# Altium schematic sheet OpAmp_CH1.SchDoc
size A4; CompanyName: Technische Hochschule Nürnberg Georg Simon Ohm; Organization: UltraZohm; Address1: Kesslerplatz 12; Address2: 90489 Nürnberg; Address3: GERMANY; DocumentNumber: 5; SheetNumber: 5; SheetTotal: 6; Website: www.ultrazohm.com
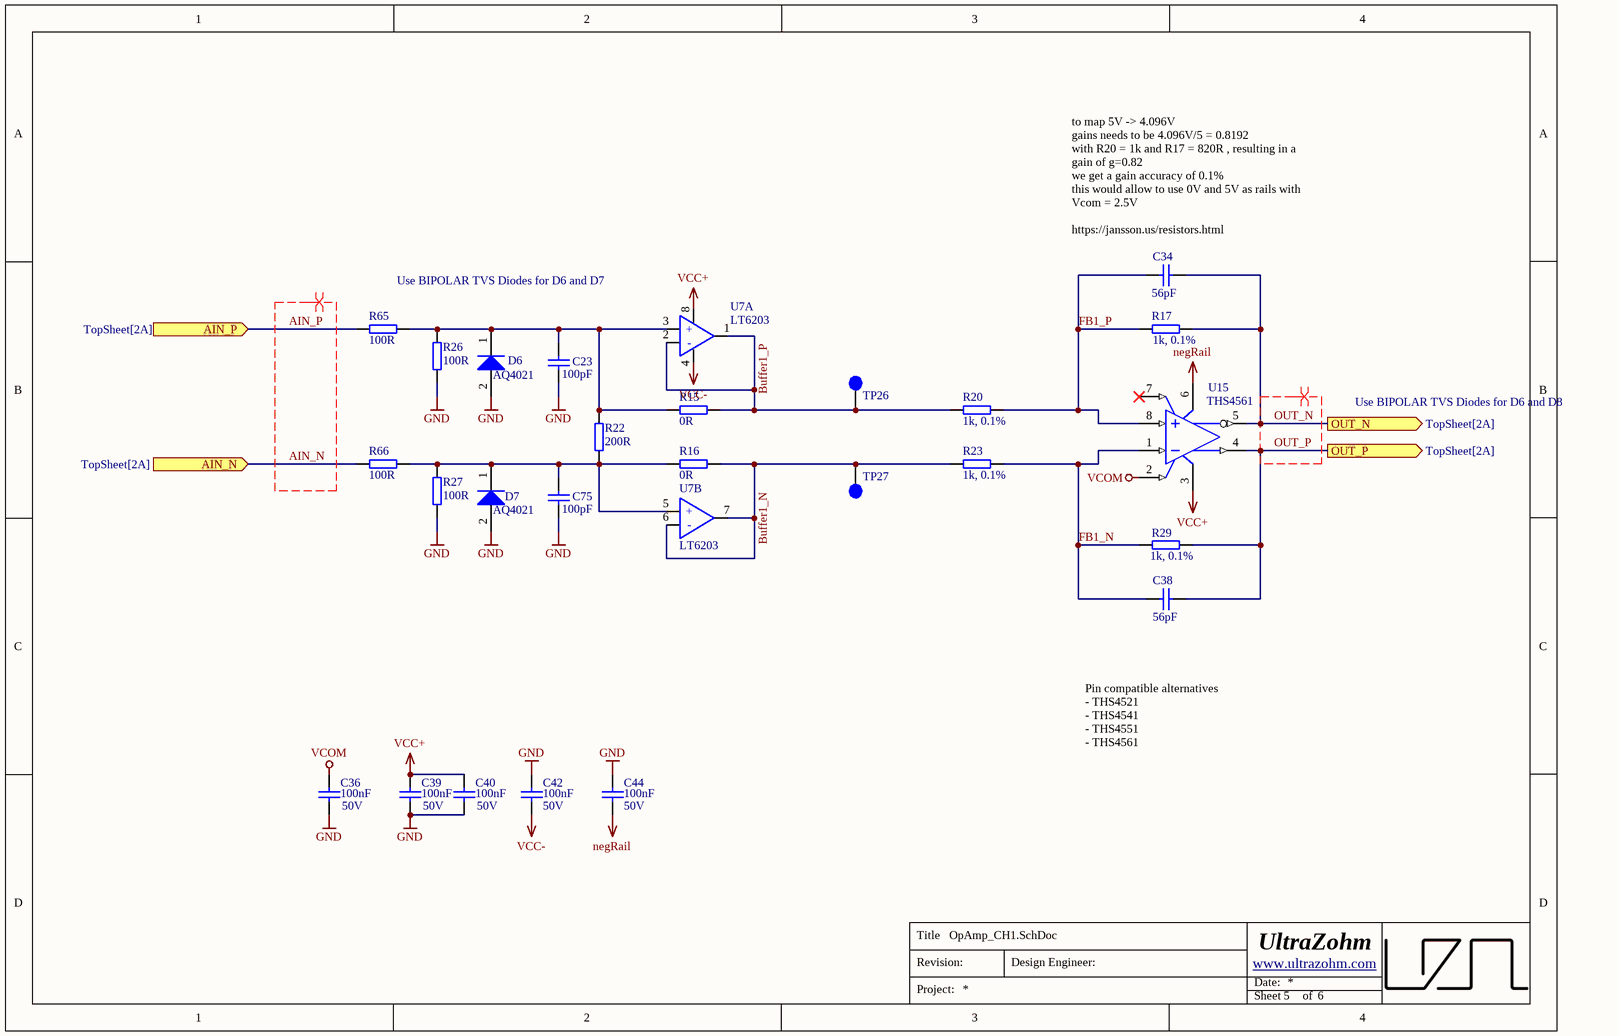
[diagram p0: OpAmp_CH1.SchDoc]

## Parts
C23  100pF  [CAPC1608X07N]
C34  56pF  [CAPC1608X07N]
C36  100nF  Voltage: 50V  [CAPC1608X07N]
C38  56pF  [CAPC1608X07N]
C39  100nF  Voltage: 50V  [CAPC1608X07N]
C40  100nF  Voltage: 50V  [CAPC1608X07N]
C42  100nF  Voltage: 50V  [CAPC1608X07N]
C44  100nF  Voltage: 50V  [CAPC1608X07N]
C75  100pF  [CAPC1608X07N]
D6  AQ4021  [SOD-323_SuppressorDiode]
D7  AQ4021  [SOD-323_SuppressorDiode]
R15  0R  [RESC1608X06N]
R16  0R  [RESC1608X06N]
R17  1k, 0.1%  [RESC1608X06N]
R20  1k, 0.1%  [RESC1608X06N]
R22  200R  [RESC3216X65N]
R23  1k, 0.1%  [RESC1608X06N]
R26  100R  [RESC1608X06N]
R27  100R  [RESC1608X06N]
R29  1k, 0.1%  [RESC1608X06N]
R65  100R  [RESC1608X06N]
R66  100R  [RESC1608X06N]
TP26  +  [TP_1mm]  (value not drawn)  (no BOM)
TP27  -  [TP_1mm]  (value not drawn)  (no BOM)
U7  LT6203  [MSOP8_3x3-8N]  (parts A,B of 2)
U15  THS4561  [DGK0008A_N]

## Ports
AIN_N (in, see TopSheet[2A]), AIN_P (in, see TopSheet[2A]), OUT_N (out, see TopSheet[2A]), OUT_P (out, see TopSheet[2A])

## Nets
GND: C23.2 C36.2 C39.2 C40.2 C42.1 C44.1 C75.2 D6.2(A) D7.2(A) R26.1 R27.1
negRail: C44.2 U15.6(VS-)
VCC+: C39.1 C40.1 U7.8 U15.3(VS+)
VCC-: C42.2 U7.4
VCOM: C36.1 U15.2(VOCM)
AIN_N: R66.1 ; port AIN_N
AIN_P: R65.1 ; port AIN_P
Buffer1_N: R16.2 R23.2 TP27.1 U7.6(-) U7.7
Buffer1_P: R15.2 R20.1 TP26.1 U7.1 U7.2(-)
FB1_N: C38.1 R23.1 R29.1 U15.1(VIN-)
FB1_P: C34.1 R17.1 R20.2 U15.8(VIN+)
OUT_N: C34.2 R17.2 U15.5(VOUT-) ; port OUT_N
OUT_P: C38.2 R29.2 U15.4(VOUT+) ; port OUT_P
NetC23_1: C23.1 D6.1(K) R15.1 R22.2 R26.2 R65.2 U7.3(+)
NetC75_1: C75.1 D7.1(K) R16.1 R22.1 R27.2 R66.2 U7.5(+)

Not connected (* = marked no-connect by the designer): U15 7(~{PD})*

## Layout directives
differential pair: AIN_N, AIN_P, OUT_N, OUT_P

## Notes on the sheet
- (near C34) to map 5V -> 4.096V
  gains needs to be 4.096V/5 = 0.8192
  with R20 = 1k and R17 = 820R , resulting in a gain of g=0.82
  we get a gain accuracy of 0.1%
  this would allow to use 0V and 5V as rails with Vcom = 2.5V
  https://jansson.us/resistors.html
- Use BIPOLAR TVS Diodes for D6 and D7
- Use BIPOLAR TVS Diodes for D6 and D8
- Pin compatible alternatives
  - THS4521
  - THS4541
  - THS4551
  - THS4561
- Title
- Revision:
- Design Engineer:
- Date:
- Project:
- Sheet
- of

## Library data of the parts
C23 C75 = Cap_0603: MPN: 885012006057; MF: Würth Elektronik; Voltage: 50V; Dielectric: NP0; Value: 100pF; Supplier 1: Mouser; Supplier 2: *; Supplier Part Number 1: 710-885012006057; Supplier Part Number 2: *; Package: 0603
C34 C38 = Cap_0603: MPN: C0603C560J5GACTU; MF: Kemet; Voltage: 50V; Dielectric: C0G; Value: 56pF; Supplier 1: Mouser; Supplier 2: *; Supplier Part Number 1: 80-C0603C560J5G; Supplier Part Number 2: *; Package: 0603
C36 C39 C40 C42 C44 = Cap_0603: MPN: CC0603KRX7R9BB104; MF: Yageo; Dielectric: X5R; Value: 100nF; Supplier 1: Mouser; Supplier 2: Mouser; Supplier Part Number 1: 603-CC603KRX7R9BB104; Supplier Part Number 2: 710-885382206004; Package: 0603
D6 D7 = GBLCxx: ESD Suppressor Diode TVS Bi-Dir 5V; MPN: AQ4021-01FTG-C; MF: Littelfuse; Reverse Standoff Voltage: 5.0V; Breakdown Voltage: 6.3V; Package: SOD-323; Supplier 1: Mouser; Supplier 2: Digi-Key; Supplier Part Number 1: 576-AQ4021-01FTG-C; Supplier Part Number 2: F10397CT-ND; ComponentLink1Description: Datasheet; Supplier 3: Farnell; Supplier Part Number 3: 2834965; Model: AQ4021
  D6: ComponentLink1URL: https://static6.arrow.com/aropdfconversion/cf1b73a38d87e210bfa153441e03466b149f09ba/gblci.pdf
  D7: ComponentLink1URL: https://www.littelfuse.com/~/media/electronics/datasheets/tvs_diode_arrays/littelfuse_tvs_diode_array_aq4021_datasheet.pdf.pdf?src-supplier=Digi-Key
R15 R16 = R_0603: MPN: CRCW06030000Z0EBC; MF: Vishay / Dale; Value: 0R; Supplier 1: Mouser; Supplier Part Number 1: 71-CRCW06030000Z0EBC; Package: 0603
R17 R20 R23 R29 = R_0603: Precision Resistor 1k 0.1% 0603; MPN: PCF-W0603LF-03-1001-B-P-LT; MF: IRC/TT Electronics; Precision: 0,1%; Value: 1k, 0.1%; Supplier 1: Mouser; Supplier Part Number 1: 66-PCFW0603LF031001B; Package: 0603; Supplier 2: RSComponents; Supplier Part Number 2: 178-6613; Supplier 3: RSComponents; Supplier Part Number 3: 520-3620
R22 = R_1206: WID SMD 1M 5% 0,25W; MPN: APC1206B200RN; AN: 22757; Mixed: SMT; Preferred: Yes; MF: AECOL/Ohmite; Case: 1206; Value: 200R; Technology: TK100; Created: 2018_07_20_AGeiger; Tolerance: 5%; Supplier 1: Mouser; Supplier Part Number 1: 284-APC1206B200RN
R26 R27 R65 R66 = R_0603: MPN: AC0603FR-13100RL; MF: Yageo; Tolerance: 1%; Value: 100R; Supplier 1: Mouser; Supplier Part Number 1: 603-AC0603FR-13100RL; Package: 0603
TP26 TP27 = TP_1mm: Testpoint 1mm; Created: 2018_06_25_AGeiger
  TP26: Value: +
  TP27: Value: -
U7 = LT6203_MSOP8: 2 Ch Low Noise, Low Power OpAmp; MPN: LT6203CMS8#PBF; MF: Linear Technology; Created: Kreppel_20190830; Package: MSOP-8; Supplier 1: Mouser; Supplier Part Number 1: 584-LT6203CMS8#PBF; ComponentLink1Description: Manufacturer; ComponentLink1URL: https://www.analog.com/en/index.html; ComponentLink2Description: Datasheet; ComponentLink2URL: https://www.analog.com/media/en/technical-documentation/data-sheets/620234fd.pdf
U15 = THS4521IDGKR: IC AMP RRO NEG OUT VLP 8VSSOP (Single Channel fully differential Amplifier); MPN: THS4561IDGKR; MF: Texas Instruments; Max Supply Voltage: 5.5V; Supplier 1: Mouser; Category: Amplifiers - Op Amps, Buffer, Instrumentation; Stock 1: 12114; Pricing 1: 1=2,55000, 10=2,29000, 25=2,16000, 100=1,78000, 250=1,59000, 500=1,54000, 1000=1,28000, 2500=1,25000, 1=2,83000, 10=2,54000, 25=2,40000, 100=1,98000, 250=1,77000, 500=1,71000 (EUR); ComponentLink1URL: https://datasheet.ciiva.com/14456/sbos458f-14456592.pdf?src-supplier=Avnet; ComponentLink1Description: old Datasheet; ComponentLink2URL: https://datasheet.ciiva.com/18622/ths4521-18622155.pdf?src-supplier=Digi-Key; ComponentLink2Description: Datasheet; ComponentLink3URL: https://www.ti.com/; ComponentLink3Description: Manufacturer; Supplier Part Number 1: 595-THS4561IDGKR; Supplier 2: Mouser; Supplier Part Number 2: 595-THS4521IDGKR